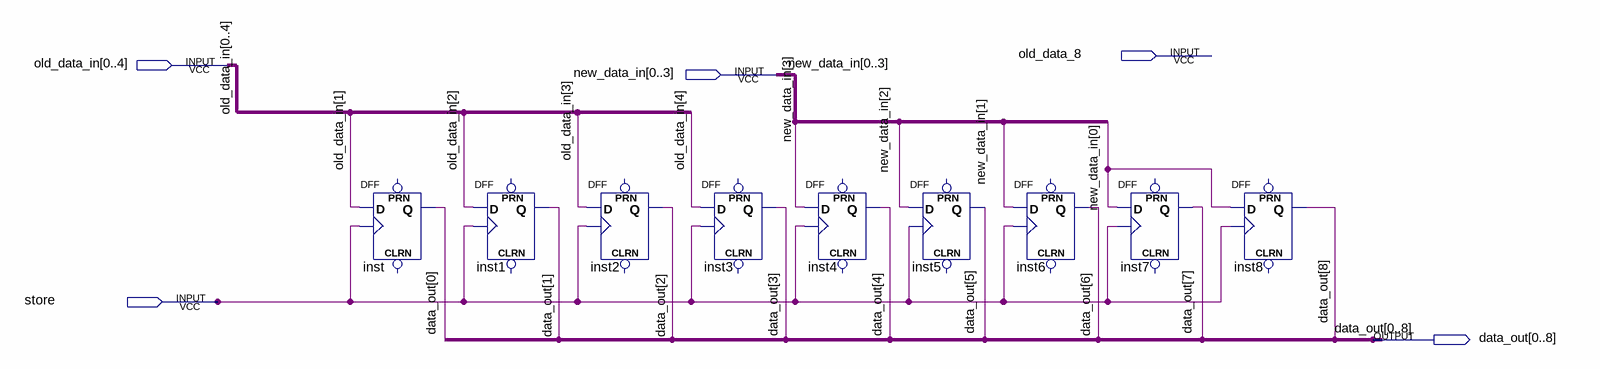
[diagram p0: schematic sheet]
// Quartus schematic temp_register.bdf as structural Verilog: 9 symbols, 5 pins
module temp_register (
  input  old_data_8,
  input  [0:4] old_data_in,
  input  [0:3] new_data_in,
  input  store,
  output [0:8] data_out
);

  DFF inst (.CLK(store), .D(old_data_in[1]), .Q(data_out[0]));  // open: CLRN, PRN
  DFF inst1 (.CLK(store), .D(old_data_in[2]), .Q(data_out[1]));  // open: CLRN, PRN
  DFF inst2 (.CLK(store), .D(old_data_in[3]), .Q(data_out[2]));  // open: CLRN, PRN
  DFF inst3 (.CLK(store), .D(old_data_in[4]), .Q(data_out[3]));  // open: CLRN, PRN
  DFF inst4 (.CLK(store), .D(new_data_in[3]), .Q(data_out[4]));  // open: CLRN, PRN
  DFF inst5 (.CLK(store), .D(new_data_in[2]), .Q(data_out[5]));  // open: CLRN, PRN
  DFF inst6 (.CLK(store), .D(new_data_in[1]), .Q(data_out[6]));  // open: CLRN, PRN
  DFF inst7 (.CLK(store), .D(new_data_in[0]), .Q(data_out[7]));  // open: CLRN, PRN
  DFF inst8 (.CLK(store), .D(new_data_in[0]), .Q(data_out[8]));  // open: CLRN, PRN
endmodule
